# EAGLE schematic royersmd (EAGLE 7.6.0)
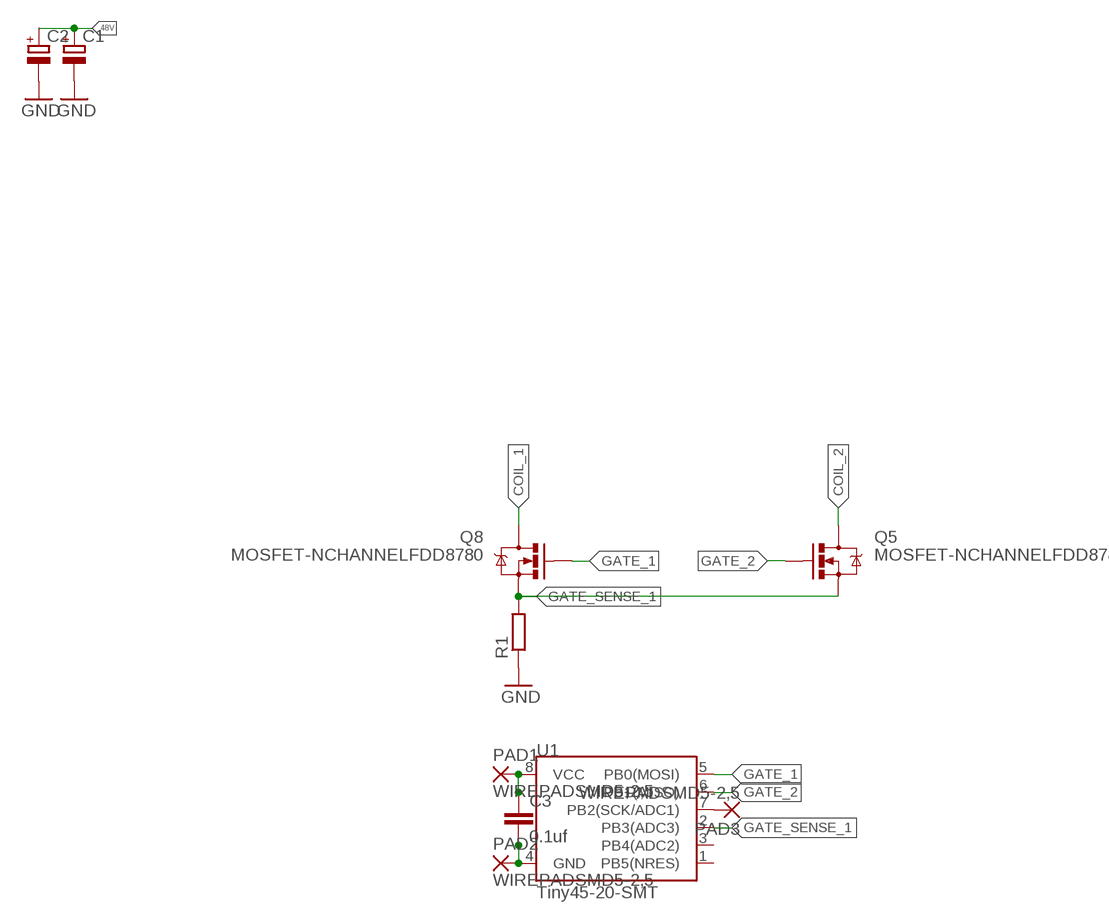
[diagram p0: schematic, sheet 1]

## Parts
C1  CPOL-EUSANYO_9F  [SANYO-OSCON_9F]
C2  CPOL-EUSANYO_9F  [SANYO-OSCON_9F]
C3  0.1uf  C-EUC0603  [C0603]
PAD1  WIREPADSMD5-2,5  [5-2,5]
PAD2  WIREPADSMD5-2,5  [5-2,5]
PAD3  WIREPADSMD5-2,5  [5-2,5]
Q5  MOSFET-NCHANNELFDD8780  [DPAK]
Q8  MOSFET-NCHANNELFDD8780  [DPAK]
R1  R-EU_M1206  [M1206]
U1  Tiny45-20-SMT  ATTINY45TINY45-20-SMT  [SO08-EIAJ]

## Nets
48V: C1.+ C2.+
COIL_1: Q8.4(D)
COIL_2: Q5.4(D)
GATE_1: Q8.1(G) U1.5(PB0(MOSI))
GATE_2: Q5.1(G) U1.6(PB1(MISO))
GATE_SENSE_1: Q5.3(S) Q8.3(S) R1.2 U1.2(PB3(ADC3))
GND: C1.- C2.- R1.1
N$1: PAD3.1(P) U1.7(PB2(SCK/ADC1))
N$3: C3.1 PAD1.1(P) U1.8(VCC)
N$4: C3.2 PAD2.1(P) U1.4(GND)
Unconnected: U1.1(PB5(NRES)) U1.3(PB4(ADC2))

## Library data of the parts
C1 C2 = rcl:CPOL-EU: POLARIZED CAPACITOR, European symbol
C3 = rcl:C-EU: CAPACITOR, European symbol
PAD1-PAD3 = wirepad:WIREPAD: Wire PAD connect wire on PCB
Q5 Q8 = SparkFun-DiscreteSemi:MOSFET-NCHANNEL: Common NMOSFET Parts MFG P/N Store ID Prod ID FDD8780 TRANS-09984 SI7820DN TRANS-11055 FDS6630A IC-08089 2N7002PW TRANS-11151 FQP30N06L COM-10213 TRANS-10060 BSS123LT1G TRANS-08345 BSS138 TRANS-00830 BS170 2N7000; PROD_ID: TRANS-09984
R1 = rcl:R-EU_: RESISTOR, European symbol
U1 = SparkFun-DigitalIC:ATTINY45: Atmel 8-pin 2/4/8kB flash uC; PROD_ID: IC-08922